# EAGLE design Arduino_S3v3_R2_ft3 (EAGLE 6.2)
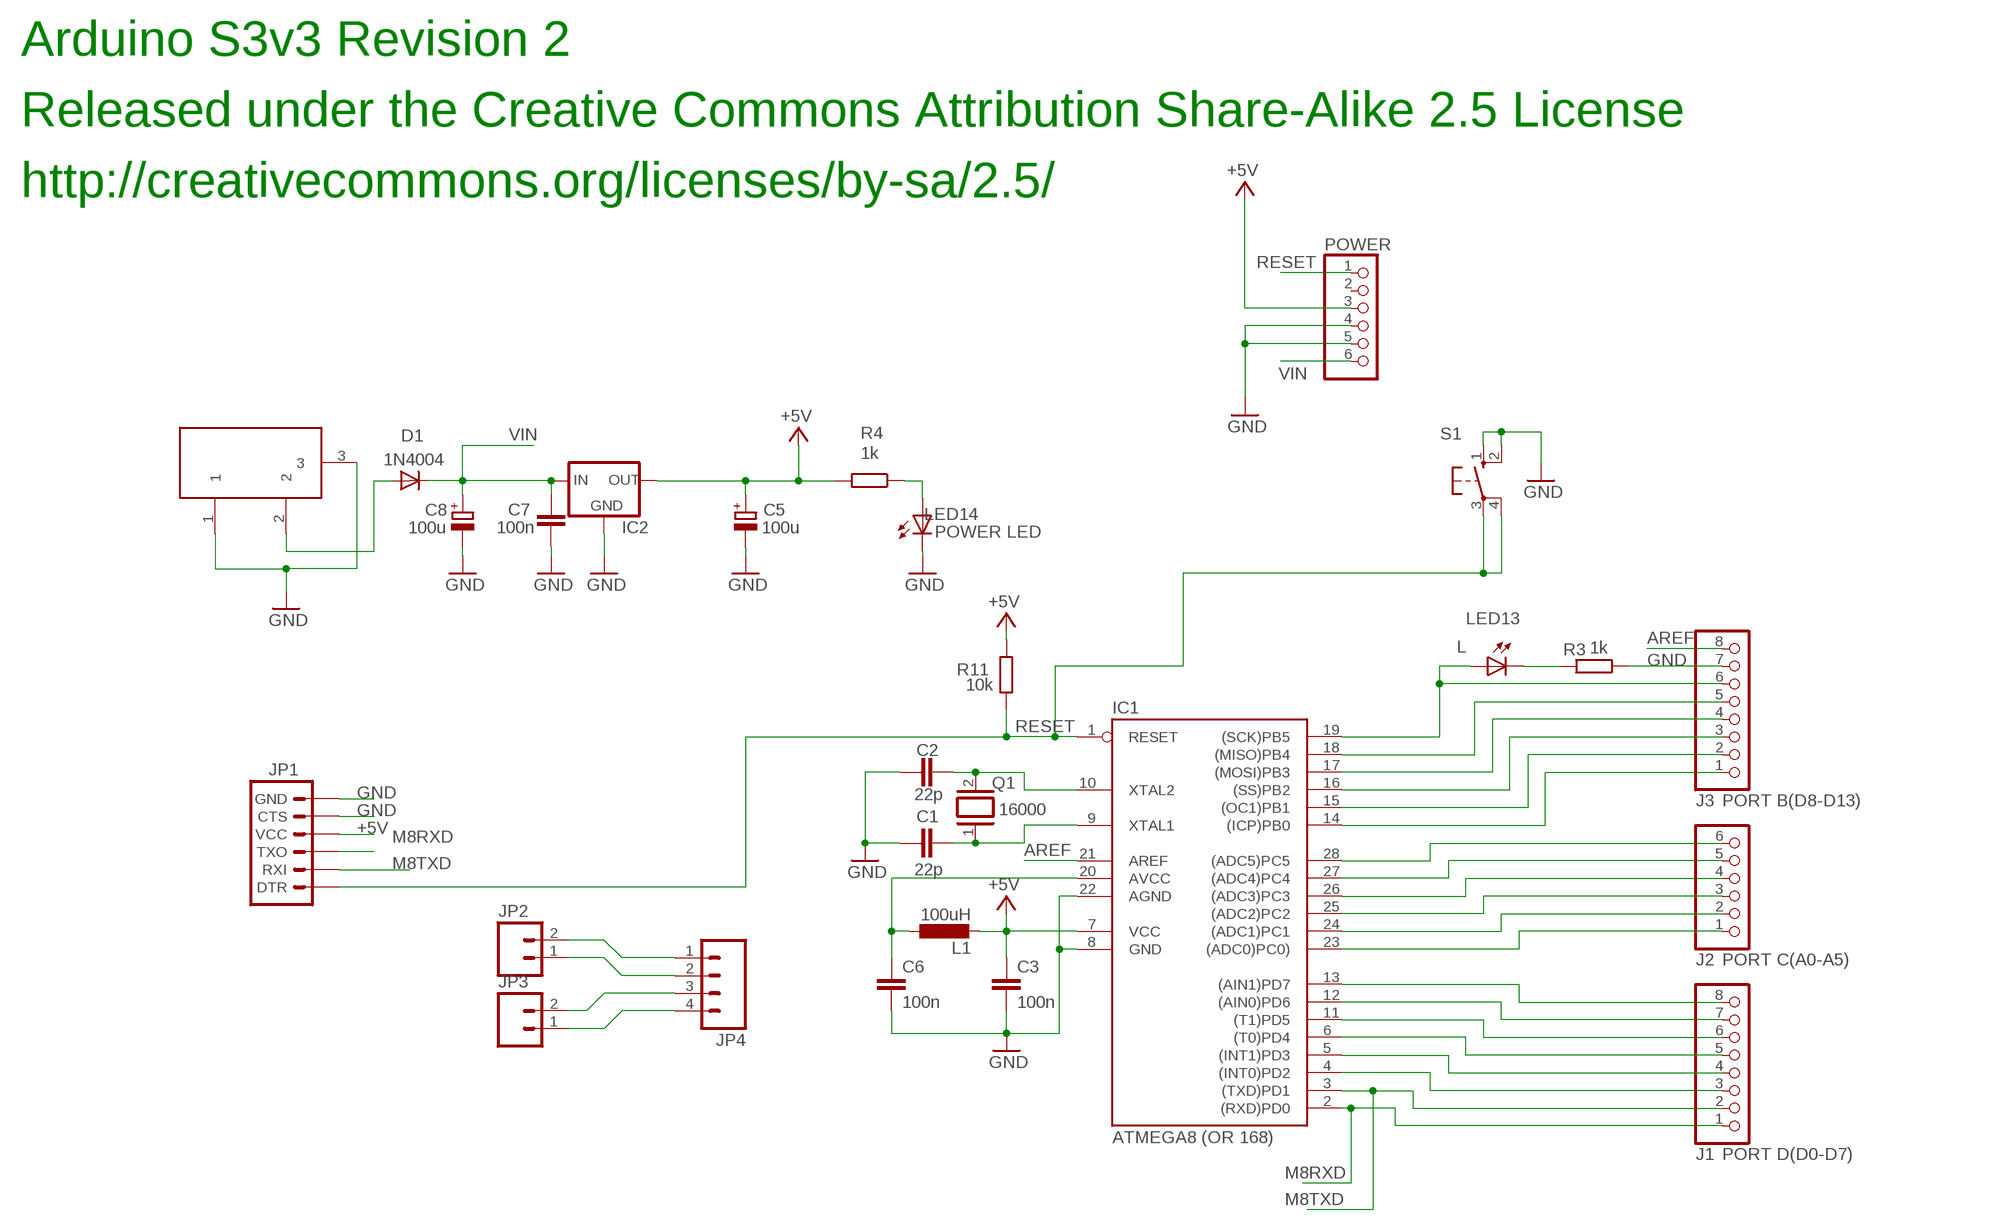
[diagram p0: schematic, sheet 1]

## Parts
C1  22p  C-EU050-025X075  [C050-025X075]
C2  22p  C-EU050-025X075  [C050-025X075]
C3  100n  C-EU050-025X075  [C050-025X075]
C5  100u  CPOL-EUE3.5-8  [E3,5-8]
C6  100n  C-EU050-025X075  [C050-025X075]
C7  100n  C-EU050-025X075  [C050-025X075]
C8  100u  CPOL-EUE3.5-8  [E3,5-8]
D1  1N4004  [DO41-10]
DC1  DC21MMX  [DC-21MM]
IC1  ATMEGA8 (OR 168)  AT90S4433P  [DIL28-3]
IC2  78XXL  [78XXL]
J1  PORT D(D0-D7)  PINHD-1X8  [1X08]
J2  PORT C(A0-A5)  PINHD-1X6  [1X06]
J3  PORT B(D8-D13)  PINHD-1X8  [1X08]
JP1  ARDUINO_SERIAL_PROGRAMLONGPADS  [1X06_LONGPADS]
JP2  M025MM  [SCREWTERMINAL-5MM-2]
JP3  M025MM  [SCREWTERMINAL-5MM-2]
JP4  M04LONGPADS  [1X04_LONGPADS]
L1  100uH  L-EU0207/10  [0207/10]
LED13  L  LED3MM  [LED3MM]
LED14  POWER LED  LED3MM  [LED3MM]
POWER  PINHD-1X6  [1X06]
Q1  16000  XTAL  [Q]
R3  1k  R-EU_0207/10  [0207/10]
R4  1k  R-EU_0207/10  [0207/10]
R11  10k  R-EU_0207/10  [0207/10]
S1  10-XX  [B3F-10XX]

## Nets
+5V [power]: C3.1 C5.+ IC1.7(VCC) IC2.OUT JP1.4(VCC) L1.2 POWER.3 R4.2 R11.2
AREF: IC1.21(AREF) J3.8
GND: C1.1 C2.1 C3.2 C5.- C6.2 C7.1 C8.- DC1.1 DC1.3 IC1.8(GND) IC1.22(AGND) IC2.GND J3.7 JP1.5(CTS) JP1.6(GND) LED14.K(C) POWER.4 POWER.5 R3.1 S1.1(S) S1.2(S1)
M8RXD: IC1.2((RXD)PD0) J1.1 JP1.3(TXO)
M8TXD: IC1.3((TXD)PD1) J1.2 JP1.2(RXI)
N$1: IC1.18((MISO)PB4) J3.5
N$2: JP3.1 JP4.4
N$3: LED14.A R4.1
N$4: IC1.17((MOSI)PB3) J3.4
N$5: IC1.14((ICP)PB0) J3.1
N$6: C1.2 IC1.9(XTAL1) Q1.1
N$7: C2.2 IC1.10(XTAL2) Q1.2
N$8: D1.A DC1.2
N$9: JP3.2 JP4.3
N$10: IC1.4((INT0)PD2) J1.3
N$11: IC1.5((INT1)PD3) J1.4
N$12: IC1.6((T0)PD4) J1.5
N$13: IC1.11((T1)PD5) J1.6
N$14: IC1.12((AIN0)PD6) J1.7
N$15: IC1.13((AIN1)PD7) J1.8
N$16: IC1.23((ADC0)PC0)) J2.1
N$17: IC1.24((ADC1)PC1) J2.2
N$18: IC1.25((ADC2)PC2) J2.3
N$19: IC1.26((ADC3)PC3) J2.4
N$20: IC1.27((ADC4)PC4) J2.5
N$21: IC1.28((ADC5)PC5) J2.6
N$22: IC1.15((OC1)PB1) J3.2
N$23: IC1.16((SS)PB2) J3.3
N$24: JP2.1 JP4.2
N$25: JP2.2 JP4.1
N$31: LED13.K(C) R3.2
N$42 [power]: C6.1 IC1.20(AVCC) L1.1
RESET: IC1.1(RESET) JP1.1(DTR) POWER.1 R11.1 S1.3(P) S1.4(P1)
SCK: IC1.19((SCK)PB5) J3.6 LED13.A
VIN [power]: C7.2 C8.+ D1.C IC2.IN POWER.6
Unconnected: POWER.2

## Notes on the sheet
- Arduino S3v3 Revision 2
- Released under the Creative Commons Attribution Share-Alike 2.5 License
- http://creativecommons.org/licenses/by-sa/2.5/

## Library data of the parts
C1-C3 C6 C7 = rcl:C-EU: CAPACITOR, European symbol
C5 C8 = rcl:CPOL-EU: POLARIZED CAPACITOR, European symbol
D1 = diode:1N4004: DIODE general purpose rectifier, 1 A
DC1 = powersupply:DC21MM
IC1 = atmel:AT90S4433: MICROCONTROLLER 4 Kbytes FLASH 128 bytes SRAM 256 bytes EEPROM UART 6-channel 10 bit ADC
IC2 = v-reg:78XXL: VOLTAGE REGULATOR
J1 J3 = pinhead:PINHD-1X8: PIN HEADER
J2 POWER = pinhead:PINHD-1X6: PIN HEADER
JP1 = SparkFun:ARDUINO_SERIAL_PROGRAM
JP2 JP3 = SparkFun:M02: Header 2 Standard 2-pin 0.1" header. Use with straight break away headers (SKU : PRT-00116), right angle break away headers (PRT-00553), swiss pins (PRT-00743), machine pins (PRT-00117), and female headers (PRT-00115). Molex polarized connector foot print use with SKU : PRT-08233 with associated crimp pins and housings.
JP4 = SparkFun:M04: Header 4 Standard 4-pin 0.1" header. Use with straight break away headers (SKU : PRT-00116), right angle break away headers (PRT-00553), swiss pins (PRT-00743), machine pins (PRT-00117), and female headers (PRT-00115). Molex polarized connector foot print use with SKU : PRT-08231 with associated crimp pins and housings.
L1 = rcl:L-EU: INDUCTOR, European symbol
LED13 LED14 = led:LED: LED OSRAM: - CHIPLED LG R971, LG N971, LY N971, LG Q971, LY Q971, LO R971, LY R971 LH N974, LH R974 LS Q976, LO Q976, LY Q976 LO Q996 - Hyper CHIPLED LW Q18S LB Q993, LB Q99A, LB R99A - SideLED LS A670, LO A670, LY A670, LG A670, LP A670 LB A673, LV A673, LT A673, LW A673 LH A674 LY A675 LS A676, LA A676, LO A676, LY A676, LW A676 LS A679, LY A679, LG A679 - Hyper Micro SIDELED® LS Y876, LA Y876, LO Y876, LY Y876 LT Y87S - SmartLED LW L88C, LW L88S LB L89C, LB L89S, LG L890 LS L89K, LO L89K, LY L89K LS L896, LA L896, LO L896, LY L896 - TOPLED LS T670, LO T670, LY T670, LG T670, LP T670 LSG T670, LSP T670, LSY T670, LOP T670, LYG T670 LG T671, LOG T671, LSG T671 LB T673, LV T673, LT T673, LW T673 LH T674 LS T676, LA T676, LO T676, LY T676, LB T676, LH T676, LSB T676, LW T676 LB T67C, LV T67C, LT T67C, LS T67K, LO T67K, LY T67K, LW E67C LS E67B, LA E67B, LO E67B, LY E67B, LB E67C, LV E67C, LT E67C LW T67C LS T679, LY T679, LG T679 LS T770, LO T770, LY T770, LG T770, LP T770 LB T773, LV T773, LT T773, LW T773 LH T774 LS E675, LA E675, LY E675, LS T675 LS T776, LA T776, LO T776, LY T776, LB T776 LHGB T686 LT T68C, LB T68C - Hyper Mini TOPLED® LB M676 - Mini TOPLED Santana® LG M470 LS M47K, LO M47K, LY M47K Source: http://www.osram.convergy.de/
Q1 = special:XTAL: CRYSTAL
R3 R4 R11 = rcl:R-EU_: RESISTOR, European symbol
S1 = switch-omron:10-XX: OMRON SWITCH

## Net classes
1 power: width 0.61 mm

## Board
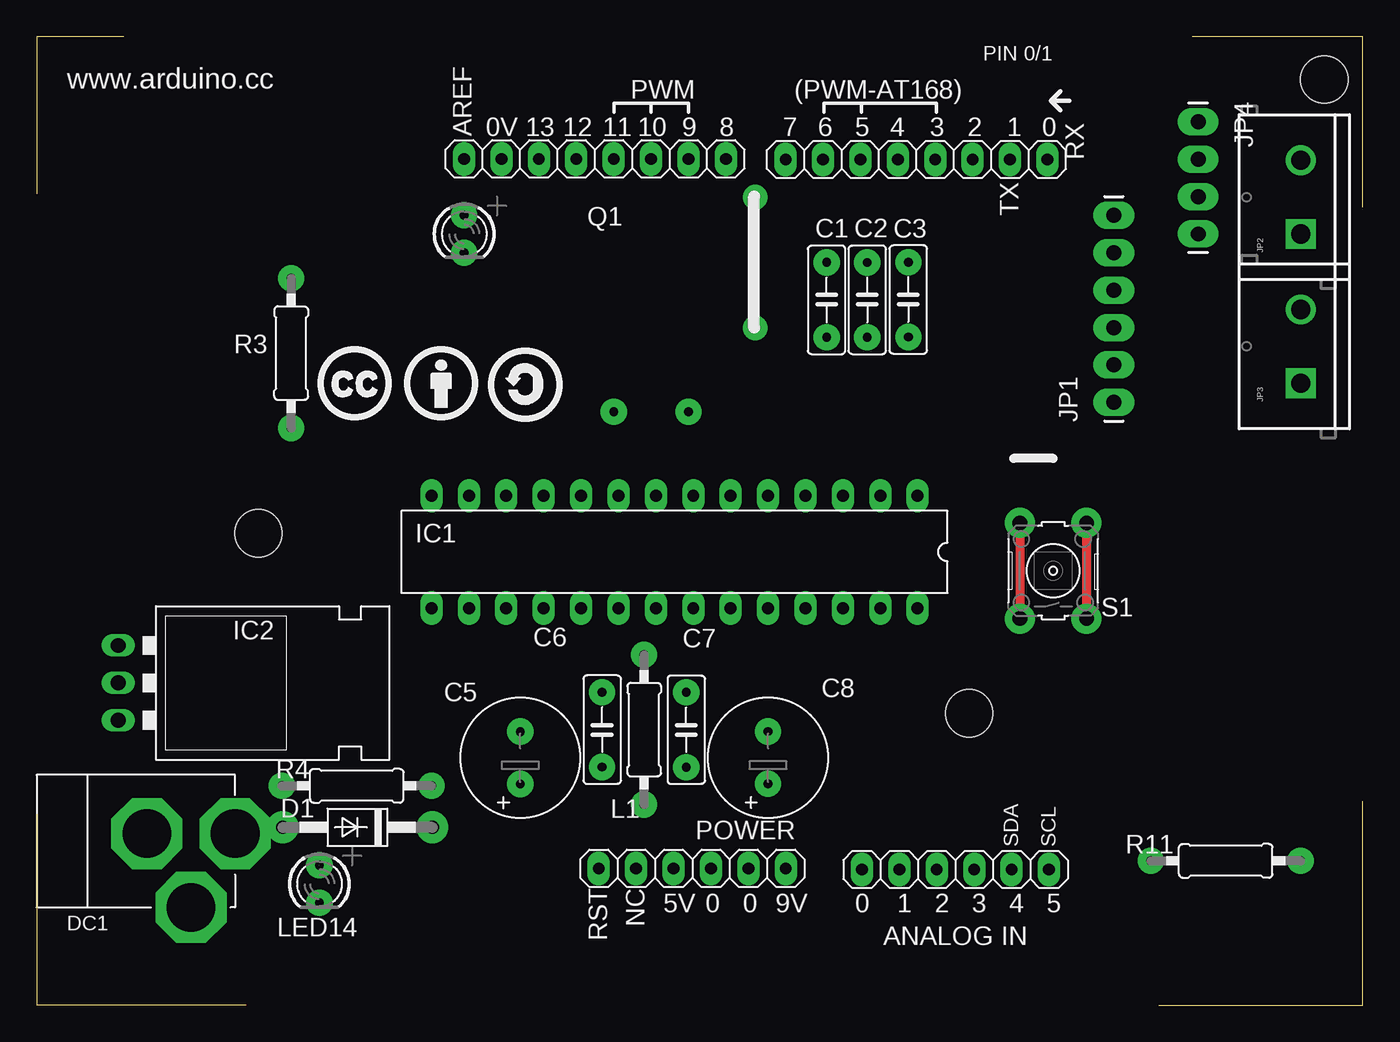
[diagram p1: board, top side]
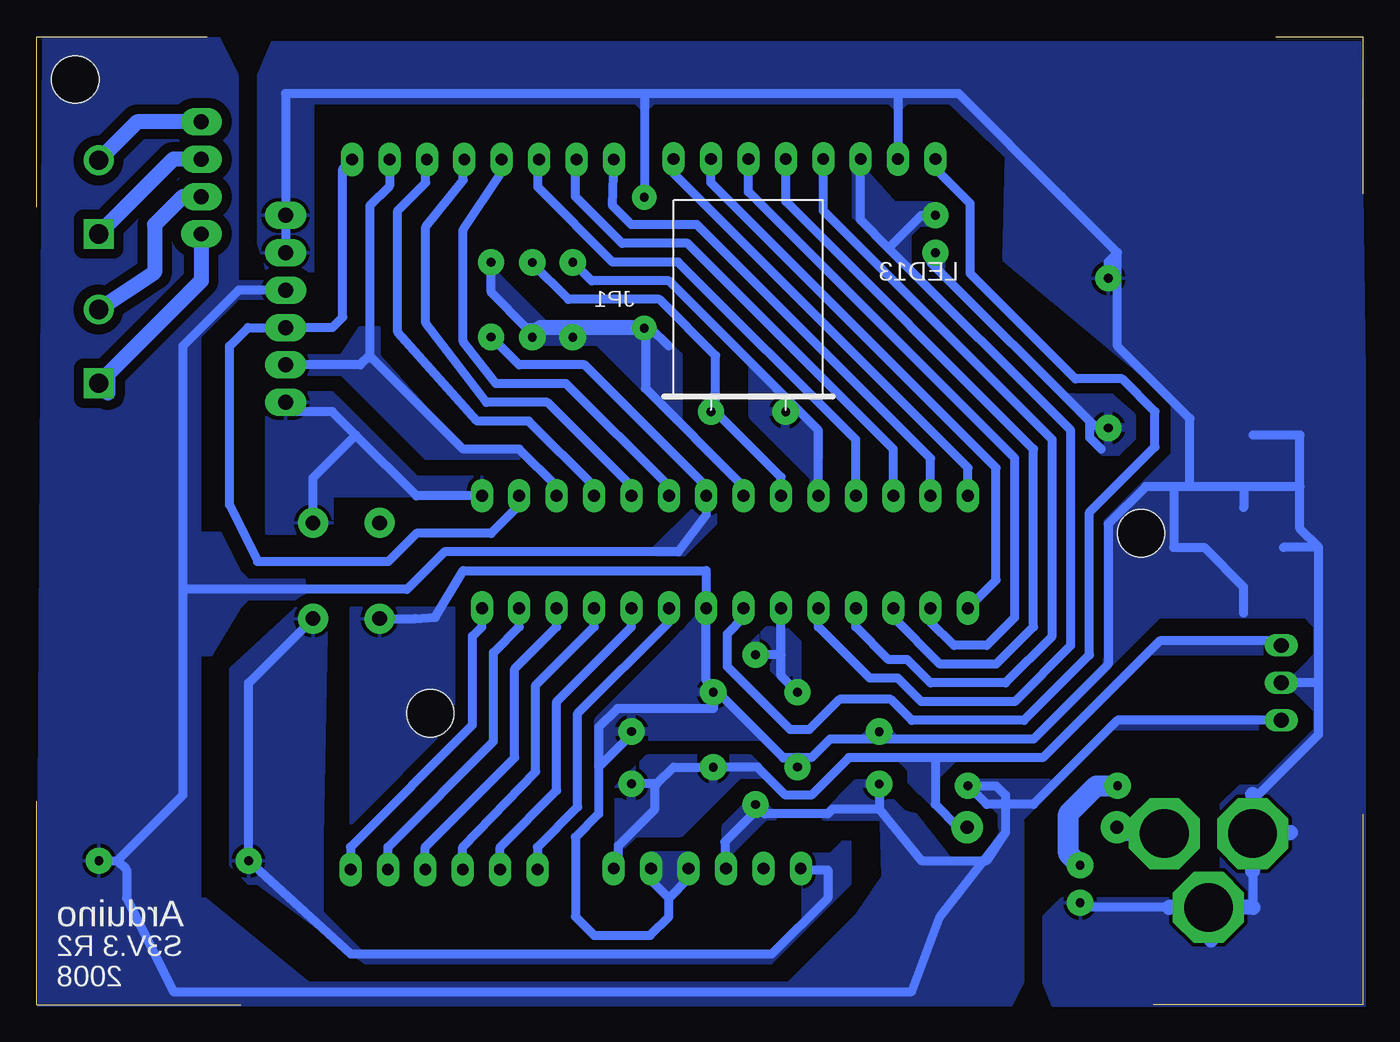
[diagram p2: board, bottom side, seen from below]

Size 90.06 x 65.74 mm. Coordinates in mm from the lower left corner, seen from the top.
Outline: 0.01,65.74 0.01,55.07
Outline: 0.01,12.95 0.01,0 14.23,0
Outline: 76.2,0 90.06,0
Outline: 90.05,65.73 78.5,65.73
Outline: 5.91,65.74 0,65.74
Outline: 90.06,0.01 90.06,13.85
Outline: 90.05,54.18 90.05,65.73
Copper layers (1*16): Top 0.035mm / dielectric 1.5mm / Bottom 0.035mm
Design rules: minimum track width 0.6mm, minimum drill 0.6mm, track to track 0.67mm, track to pad 0.67mm, pad to pad 0.67mm, via to via 0.67mm, smd to smd 0mil, copper to edge 0mil, drill to drill 8mil, minimum pad ring 10mil, minimum via ring 8mil, stop-mask expansion 0mil, vias tented up to drill 0mil, thermal gap 10mil
Holes 3.2 mm at 87.45,62.83 63.32,19.81 15.06,32.03

### Footprints (pad centres in the part's own frame; a part is rotated, then mirrored left to right if it is on the bottom)
C050-025X075 = drill 0.6 pad 1.778: 1 -2.54,0; 2 2.54,0
E3,5-8 = drill 0.6 pad 1.778: + -1.778,0; - 1.778,0
DO41-10 = drill 0.9 pad 2.159: A 5.08,0; C -5.08,0
DC-21MM = drill 3.302 pad 4.826 octagon: 1 -5.08,-3.353; 2 -0.076,-6.35; 3 -0.076,-0.356
DIL28-3 = drill 0.813 pad 1.524 long: 1 -16.51,-3.81; 2 -13.97,-3.81; 3 -11.43,-3.81; 4 -8.89,-3.81; 5 -6.35,-3.81; 6 -3.81,-3.81; 7 -1.27,-3.81; 8 1.27,-3.81; 9 3.81,-3.81; 10 6.35,-3.81; 11 8.89,-3.81; 12 11.43,-3.81; 13 13.97,-3.81; 14 16.51,-3.81; 15 16.51,3.81; 16 13.97,3.81; 17 11.43,3.81; 18 8.89,3.81; 19 6.35,3.81; 20 3.81,3.81; 21 1.27,3.81; 22 -1.27,3.81; 23 -3.81,3.81; 24 -6.35,3.81; 25 -8.89,3.81; 26 -11.43,3.81; 27 -13.97,3.81; 28 -16.51,3.81
78XXL = drill 1.016 long: GND 0,-3.81; IN -2.54,-3.81; OUT 2.54,-3.81
1X08 = drill 0.8 pad 1.524 long: 1 -8.89,0; 2 -6.35,0; 3 -3.81,0; 4 -1.27,0; 5 1.27,0; 6 3.81,0; 7 6.35,0; 8 8.89,0
1X06 = drill 0.8 pad 1.524 long: 1 -6.35,0; 2 -3.81,0; 3 -1.27,0; 4 1.27,0; 5 3.81,0; 6 6.35,0
1X06_LONGPADS = drill 1.016 pad 1.88 long: 1 0,0; 2 2.54,0; 3 5.08,0; 4 7.62,0; 5 10.16,0; 6 12.7,0
SCREWTERMINAL-5MM-2 = drill 1.3 pad 2.032 square: 1 0,0 | drill 1.3 pad 2.032: 2 5,0
1X04_LONGPADS = drill 1.016 pad 1.88 long: 1 0,0; 2 2.54,0; 3 5.08,0; 4 7.62,0
0207/10 = drill 0.6 pad 1.778: 1 -5.08,0; 2 5.08,0
LED3MM = drill 0.6 pad 1.778: A -1.27,0; K 1.27,0
Q = drill 0.6 pad 1.778: 1 -2.54,-7.62; 2 2.54,-7.62
B3F-10XX = drill 1 pad 2.032: 1 -3.251,2.261; 2 3.251,2.261; 3 -3.251,-2.261; 4 3.251,-2.261

### Placement (x,y rotation side)
C1  56.41,47.88 90 top
C2  53.65,47.88 90 top
C3  59.2,47.9 90 top
C5  32.84,16.79 90 top
C6  38.4,18.7 270 top
C7  44.11,18.69 270 top
C8  49.67,16.79 90 top
D1  21.79,12.07 180 top
DC1  7.12,11.71 90 top
IC1  43.32,30.76 180 top
IC2  9.35,21.87 270 top
J1  59.75,57.41 180 top
J2  62.4,9.2 0 top
J3  37.91,57.45 180 top
JP1  73.16,40.92 90 top
JP2  85.86,52.35 90 top
JP3  85.86,42.23 90 top
JP4  78.88,59.97 270 top
L1  41.25,18.7 270 top
LED13  29.03,52.35 270 top
LED14  19.19,8.22 270 top
POWER  44.52,9.28 0 top
Q1  41.73,47.91 0 bottom
R3  17.28,44.26 270 top
R4  21.73,14.89 0 top
R11  80.76,9.79 0 top
S1  69.04,29.49 90 top
U$1  [CC]  19.03,39.65 0 top
U$2  [BY]  24.9,39.65 0 top
U$3  [SA]  30.62,39.65 0 top

### Tracks (layer width: path | path; a pad name or v marks a point on that pad's centre or on a via)
+5V
  Bottom 0.61: IC2.OUT 16.65,19.33 22.36,13.62 24.27,13.62 | 24.27,13.62 25.54,13.62 R4.2 24.9,14.89 24.27,14.25 24.27,13.62 | C3.1 57.92,44.09 57.29,43.46 52.84,43.46 44.59,35.21 IC1.7 44.59,33.3 46.49,30.76 62.37,30.76 64.91,28.22 80.15,28.22 | POWER.3 43.25,8.61 43.32,8.54 43.32,11.08 41.25,13.14 L1.2 40.62,12.98 36.33,12.98 36.01,13.3 32.84,13.3 | JP1.4 76.34,48.54 80.15,44.73 80.15,28.22 | 80.15,28.22 80.15,14.25 84.61,9.79 R11.2 | 84.59,9.81 83.96,9.17 83.96,7.27 80.78,0.92 30.62,0.92 28.71,6 24.27,11.71 | 24.27,13.62 24.27,11.71 | C5.+ 32.84,13.3 | 32.84,13.3 29.98,9.81 25.54,9.81 24.27,11.71
  Bottom 1.016: C3.1
  pour Bottom: 23,14.25 25.86,9.97 27.92,9.97 30.3,12.98 32.84,13.62 32.68,8.7 34.43,6.16 39.03,1.55 71.58,1.55 78.56,7.27 78.88,7.27 78.88,45.37 76.34,47.91 73.8,47.91 73.8,49.18 76.34,49.18 76.34,63.15 77.61,65.69 89.67,65.69 89.99,13.94 89.99,-0.04 23.79,-0.04 23,1.55
  pour Bottom (no thermals): 7.12,18.7 17.6,18.7 16.65,19.65 7.12,19.65
  pour Bottom: 31.09,12.82 33.32,15.05 34.35,15.05 36.57,12.82
  pour Bottom (no thermals): 39.98,12.82 40.62,12.82 43.24,10.2 43.24,12.11 41.25,14.09
  pour Bottom: 24.27,12.03 24.27,13.14 26.01,14.89 21.41,14.89
  pour Bottom: 80.15,32.03 77.61,32.03 76.34,29.49 75.7,28.86 71.89,28.86 71.89,27.59 75.7,27.59 76.34,26.95 78.24,23.78 80.15,23.78
  pour Bottom: 45.22,33.94 43.95,33.94 43.95,32.67 46.49,30.13 47.13,30.13 48.4,30.76
AREF
  Bottom 0.6: IC1.21 42.05,26.64 42.05,26.32 43.16,25.21 43.16,22.98 41.25,21.08 38.87,18.7 37.6,18.7 35.54,20.76 32.05,20.76 30.62,19.33 23,19.33 18.55,23.78 18.55,33.46 14.11,37.91 14.11,40.29 16.33,42.51 19.5,42.51 26.65,49.65 26.65,54.42 28.71,56.48 28.71,57.43 J3.8
GND  (via drill 0.6 pad 1.68)
  Top 0.6: 48.72,54.85 48.72,45.96 v48.79,45.96 | 48.72,54.85 48.72,54.89 | v48.79,54.85 48.72,54.85
  Top 0.61: S1.2 S1.1
  Bottom 0.6: 42.05,35.21 | 42.05,35.21 48.72,41.87 48.72,46 48.75,46 v48.79,45.96 | 48.79,61.88 v48.79,54.85 | 4.26,35.21 4.26,38.7 | 11.73,35.21 11.73,39.81 16.65,44.73 16.65,51.08 | 20.46,54.89 27.44,61.88 31.57,61.88 | J3.7 31.57,57.12 31.57,61.88 | 31.57,61.88 48.79,61.88 | 4.26,35.21 8.07,35.21 | 8.07,35.21 11.73,35.21 | 11.73,35.21 12.84,35.21 | 2.99,21.87 2.99,31.08 | 2.99,31.08 4.26,32.35 4.26,35.21 | 13.16,6.64 10.5,6.64 | 13.16,6.64 13.47,6.63 19.19,6.64 LED14.K | 44.11,20.13 50.62,20.13 51.89,18.86 51.89,16.16 | 51.89,16.16 51.89,12.98 53.48,11.4 53.48,6 52.21,4.73 48.4,4.73 47.13,6 47.13,7.27 | 2.99,21.87 IC2.GND | 10.3,6.63 13.16,6.64 | 7.44,6.63 7.44,11.71 7.47,13.62 | 2.99,21.87 2.99,18.38 7.44,13.94 7.47,13.62 | 7.47,13.62 7.48,14.29 | 47.13,7.27 48.4,8.54 48.4,9.17 48.33,9.17 POWER.5 | POWER.4 45.79,8.61 47.13,7.27 | 47.13,44.73 48.4,46 | 48.79,61.88 69.35,61.88 | 12.84,35.21 14.74,35.21 17.28,32.67 17.28,23.14 22.36,18.06 32.84,18.06 | 12.84,35.21 12.84,31.08 10.77,31.08 | 2.99,31.08 5.38,31.08 | 8.07,35.21 8.07,33.78 | 8.07,26.64 8.07,28.38 | 32.84,18.06 36.17,18.06 37.44,16.79 38.4,16.79 C6.2 38.4,16.79 39.34,16.79 43.95,21.4 | C5.- 32.84,18.06 | 55.86,46 56.81,46 59.19,48.39 59.19,50.13 59.19,50.28 C3.2 | 43.95,21.4 44.43,21.87 44.46,21.87 44.11,20.6 44.11,20.13 | C7.1 44.11,20.92 44.11,20.13 | C8.- 49.67,18.38 51.89,16.16 | 43.95,21.4 | IC1.22 44.59,22.03 43.95,21.4 | 53.64,46 53.64,45.84 53.65,45.83 C2.1 | 42.05,35.21 IC1.8
  Bottom 0.61: 8.07,28.38 10.77,31.08 | 4.26,38.7 7.44,38.7 | R3.1 17.28,50.45 16.65,51.08 20.46,54.89 | 69.35,61.88 73.16,61.88 JP1.6 JP1.5 | IC1.22 44.59,29.49 61.1,29.49 63,26.32 64.35,26.24 S1.1
  Bottom 1.016: 7.48,14.29 7.48,9.11 | 4.9,11.71 7.44,11.71 9.35,11.71 | 7.44,6.63 10.3,6.63 | 10.3,6.63 13.16,6.63 | 10.3,6.63 10.3,4.41 | 56.49,45.37 55.87,45.99 | 55.87,45.99 55.86,46 | 48.72,46 53.64,46 55.87,45.99
  pour Bottom: 11.25,7.27 20.46,7.27 21.73,6 21.73,1.55 21.09,-0.04 -0.18,-0.04 -0.18,42.83 0.14,65.37 74.12,65.37 75.07,63.15 75.07,51.72 74.43,49.81 71.26,49.81 71.26,61.24 28.08,61.24 24.27,57.59 24.43,50.61 13,41.08 13,37.43 17.6,32.83 17.6,22.51 13.79,26.32 3.95,26.32 3.31,25.68 3.31,18.7 7.12,14.89 8.39,14.89 9.66,13.62 9.66,8.86
  pour Bottom: 46.49,44.1 46.49,39.65 52.84,46 48.4,46
  pour Bottom: 47.76,61.88 48.79,60.92 49.75,61.88
  pour Bottom: 30.62,61.88 31.57,60.92 32.52,61.88
  pour Bottom (no thermals): 45.7,10.12 48.4,10.12 48.4,8.86 47.13,7.58 45.7,9.01
  pour Bottom: 16.65,7.27 19.98,7.27 19.98,3.46 19.03,2.5 16.65,2.5
  pour Bottom (no thermals): 4.58,22.51 2.68,24.41 2.68,19.33 4.58,21.24
  pour Bottom (no thermals): 70.62,26.79 70.78,26.64 72.21,26.64 72.37,26.79
  pour Bottom (no thermals): 59.19,49.81 55.54,46.16 52.84,46.16 51.73,45.05 55.86,45.05 59.19,48.38
  pour Bottom: 51.89,19.33 46.97,24.25 44.59,24.25 44.59,22.03 40.78,18.22 49.83,18.22 51.89,16.16
  pour Bottom (no thermals): 46.97,24.25 44.59,26.79 44.59,24.25
  pour Bottom (no thermals): 32.84,19.17 31.73,18.06 33.95,18.06
  pour Bottom: 68.72,26.95 61.73,26.95 61.73,19.33 68.72,12.35
M8RXD
  Bottom 0.61: IC1.2 57.29,33.94 59.19,32.03 64.27,32.03 66.18,30.13 75.07,30.13 76.97,33.94 76.97,44.73 75.7,46 JP1.3 69.99,46 69.28,46.71 69.28,56.77 J1.1
M8TXD
  Bottom 0.61: J1.2 66.1,55.6 67.45,54.26 67.45,44.1 | 67.45,44.1 68.08,43.46 JP1.2 | IC1.3 54.75,35.21 57.29,37.75 61.1,37.75 67.45,44.1
  pour Bottom: 68.08,46 69.35,44.1 72.53,44.1 72.53,42.83 69.35,42.83 63.64,37.11 57.29,37.11 57.29,37.75 61.1,37.75 66.81,44.1 66.81,46
N$1
  Bottom 0.6: J3.5 36.64,53.93 21.09,38.38 21.09,25.05 24.27,21.87 29.35,21.87 30.93,23.46 32.21,23.46 34.43,25.68 IC1.18
N$2
  Bottom 1.016: JP4.4 78.88,49.18 85.23,42.83 85.23,41.56 JP3.1
N$3  (1 unrouted)
  Bottom 0.6: R4.1
  Bottom 1.422: R4.1 18.08,14.89 19.98,12.98 19.98,10.28 LED14.A
N$4
  Bottom 0.6: J3.4 39.18,54.57 22.36,37.75 22.36,25.68 24.9,23.14 28.71,23.14 31.89,26.32 IC1.17
N$5
  Bottom 0.6: IC1.14 26.81,36.48 46.81,56.48 46.81,57.12 J3.1
N$6
  Bottom 0.6: IC1.9 39.51,35.84 43.95,40.29 | 43.95,40.29 Q1.1 | 43.95,40.29 43.95,44.1 47.76,47.91 53.95,47.91 56.49,50.45 C1.2
  pour Bottom (no thermals): 44.27,39.65 43,39.65 43.95,40.6 43.95,41.88 44.91,40.92 44.91,40.29
N$7
  Bottom 0.6: 38.87,40.92 39.83,41.88 | 38.87,40.92 47.13,49.18 52.37,49.18 53.64,50.45 53.65,50.45 C2.2 | IC1.10 36.97,39.02 38.87,40.92 | 38.87,40.92 Q1.2
  pour Bottom: 36.97,37.11 38.56,37.11 41.41,39.97 41.41,43.46 36.97,39.02
  pour Bottom (no thermals): 38.56,37.11 37.29,35.84 37.29,35.05 36.97,35.05 36.97,37.11
N$8
  Bottom 0.6: 16.65,12.03 16.65,12.07
  Bottom 1.016: 16.65,12.07 D1.A | DC1.2 16.25,11.64 16.65,12.03
N$9
  Bottom 1.016: JP4.3 80.15,54.89 82.05,52.99 82.05,49.73 JP3.2
N$10
  Bottom 0.6: IC1.4 52.21,35.21 56.65,39.65 60.15,39.65 65.54,45.68 65.54,53.94 63.64,55.84 63.64,57.43 J1.3
N$11
  Bottom 0.6: IC1.5 49.67,35.21 55.38,40.92 59.51,40.92 63.64,46.32 63.64,52.83 61.1,56 61.1,57.43 J1.4
N$12
  Bottom 0.6: IC1.6 47.13,35.21 54.11,42.19 58.87,42.19 61.1,45.05 61.1,52.67 58.56,56.48 58.56,57.43 J1.5
N$13
  Bottom 0.6: IC1.11 34.43,38.38 46.49,50.45 50.94,50.45 56.02,55.53 56.02,57.41 | 56.02,57.41 56.02,57.43 | 56.02,57.41 J1.6
N$14
  Bottom 0.6: IC1.12 31.89,37.75 45.86,51.72 50.3,51.72 53.48,54.89 53.48,57.41 | 53.48,57.41 53.48,57.43 | 53.48,57.41 J1.7
N$15
  Bottom 0.6: IC1.13 29.35,37.11 45.22,52.99 49.67,52.99 50.94,54.26 J1.8
N$16
  Bottom 0.6: IC1.23 47.13,26 53.32,19.81 53.32,13.46 56.05,10.73 J2.1
N$17
  Bottom 0.6: IC1.24 49.67,25.68 54.75,20.6 54.75,14.57 58.59,10.73 J2.2
N$18
  Bottom 0.6: IC1.25 52.21,25.68 56.18,21.71 56.18,15.84 61.13,10.73 J2.3
N$19
  Bottom 0.6: IC1.26 54.75,25.68 57.61,22.82 57.61,16.79 63.67,10.73 J2.4
N$20
  Bottom 0.6: IC1.27 57.29,25.68 59.03,23.94 59.03,17.9 66.21,10.73 J2.5
N$21
  Bottom 0.6: IC1.28 59.83,25.68 60.46,25.05 60.46,19.02 68.75,10.73 J2.6
N$22
  Bottom 0.6: IC1.15 24.9,28.86 24.9,36.48 44.27,55.84 44.27,57.12 J3.2
N$23
  Bottom 0.6: IC1.16 29.35,26 27.76,24.41 25.54,24.41 23.63,26.32 23.63,37.11 41.73,55.21 41.73,57.12 | 41.73,57.12 41.73,57.43 | 41.73,57.12 J3.3
N$24
  Bottom 1.016: JP4.2 80.78,57.43 JP2.1
N$25
  Bottom 1.016: JP4.1 83.24,59.97 JP2.2
N$31
  Bottom 0.6: 18.24,39.34 29.35,50.45 29.35,51.08 LED13.K | R3.2 | R3.2 | R3.2 17.28,39.34 18.24,39.34 | 17.76,37.75 18.55,38.54 18.55,39.49 18.39,39.34 18.24,39.34
  pour Bottom (no thermals): 28.4,51.08 28.4,49.49 29.35,50.45 29.35,51.08
  pour Bottom: 15.7,38.54 15.7,39.97 17.12,41.24 20.14,41.24 18.55,39.65 18.55,38.54 17.6,37.59 16.65,37.59
N$42
  Bottom 0.6: 39.51,23.78 39.51,22.35 C6.1 | 39.51,23.78 IC1.20 | 39.51,23.78 | 39.51,23.78 L1.1
  pour Bottom: 38.4,21.24 38.4,24.57 39.51,25.68 39.51,26.32 41.41,24.41 41.41,24.25
RESET
  Top 0.61: S1.4 S1.3
  Bottom 0.6: 64.27,34.57
  Bottom 0.61: POWER.1 38.17,9.24 38.24,9.17 36.33,9.17 36.33,7.27 40.14,3.46 68.71,3.46 R11.1 75.68,21.86 S1.3 | 68.4,38.7 69.99,40.29 72.53,40.29 JP1.1 | S1.4 71.3,35.8 68.4,38.7 | IC1.1 64.27,34.57 | 64.27,34.57 68.4,38.7
  pour Bottom: 72.53,26.95 76.97,22.82 76.97,9.49 75.7,8.22 75.07,8.22 67.77,2.82 40.14,2.82 34.75,8.22 34.75,11.08 35.38,11.08 36.17,10.28 38.08,10.28 38.08,5.84 40.78,3.14 67.45,3.14 70.62,6.32 70.62,11.39 70.31,26.95
  pour Bottom: 59.83,35.84 64.27,35.84 69.99,41.56 74.43,41.56 74.43,32.03 69.99,32.03 69.99,34.57 59.83,34.57
SCK
  Bottom 0.6: IC1.19 36.97,25.68 33.48,22.19 31.57,22.19 29.98,20.6 23.63,20.6 19.82,24.41 19.82,39.02 32.21,51.4 | 32.21,51.4 34.11,53.3 34.11,57.43 J3.6 | LED13.A 29.98,53.62 32.21,51.4
  pour Bottom (no thermals): 30.94,50.13 30.94,52.35 30.14,53.15 29.03,53.15 29.03,53.94 29.35,54.26 31.89,54.26 34.43,57.12 34.43,53.62
VIN
  Bottom 0.6: IC2.IN 6.17,24.73 13.79,24.73 21.73,16.79 29.03,16.79 | D1.C 27.48,12.07 29.03,13.62 29.03,16.79 | C7.2 41.09,16.16 39.19,14.25 37.44,14.25 34.9,16.79 29.03,16.79 | 48.08,15.01 47.95,15.01 46.81,16.16 C7.2 | 48.08,15.01 C8.+ | POWER.6 50.87,9.56 50.54,9.89 50.55,10.83 48.08,13.3 48.08,15.01 | 48.08,15.01 48.08,15.05
  pour Bottom (no thermals): 6.81,23.78 14.74,23.78 13.79,24.73 6.81,24.73
  pour Bottom: 41.65,16.71 48.56,16.71 50.54,14.73 50.54,10.6 49.43,11.71 46.33,11.71 42.37,15.68 40.62,15.68
  pour Bottom: 27.76,16.79 29.03,15.52 29.03,13.62 30.62,15.21 30.62,16 31.41,16.79

### Text on the board
tNames: PIN 0/1 | www.arduino.cc | PWM | (PWM-AT168) | AREF | 0V | 13 | 12 | 11 | 10 | 9 | 8 | 7 | 6 | 5 | 4 | 3 | 2 | 1 | 0 | RX | TX | SDA | SCL | 5V | 0 | 0 | 9V | 0 | 1 | 2 | 3 | 4 | 5 | NC | RST | ANALOG IN
bNames: LED13 | JP1 | Arduino | S3V.3 R2 | 2008
bValues: ENABLE
bRestrict: 2012 | atomsfat.github.com | CC BY SA 2.5
tCredits: ADILSON AKASHI | MASSIMO BANZI | DAVID CUARTIELLES | TOM IGOE | GIANLUCA MARTINO | DAVID A. MELLIS | NICHOLAS ZAMBETTI | Released under the Creative Commons Attribution Share-Alike 2.5 License | http://creativecommons.org/licenses/by-sa/2.5/
Cooper Text: A | 0 | 13 | 12 | 11 | 10 | 9 | 8 | 7 | 6 | 5 | 4 | 3 | 2 | 1 | 0 | R | 5 | 0 | 0 | 9 | 0 | 1 | 2 | 3 | 4 | 5 | Analog in
bCredits: ADILSON AKASHI | MASSIMO BANZI | DAVID CUARTIELLES | TOM IGOE | GIANLUCA MARTINO | DAVID A. MELLIS | NICHOLAS ZAMBETTI | Released under the Creative Commons Attribution Share-Alike 2.5 License | http://creativecommons.org/licenses/by-sa/2.5/